# Altium schematic sheet CAN_Transceiver.SchDoc
size 259 x 167 mm; SheetNumber: 12; SheetTotal: 15
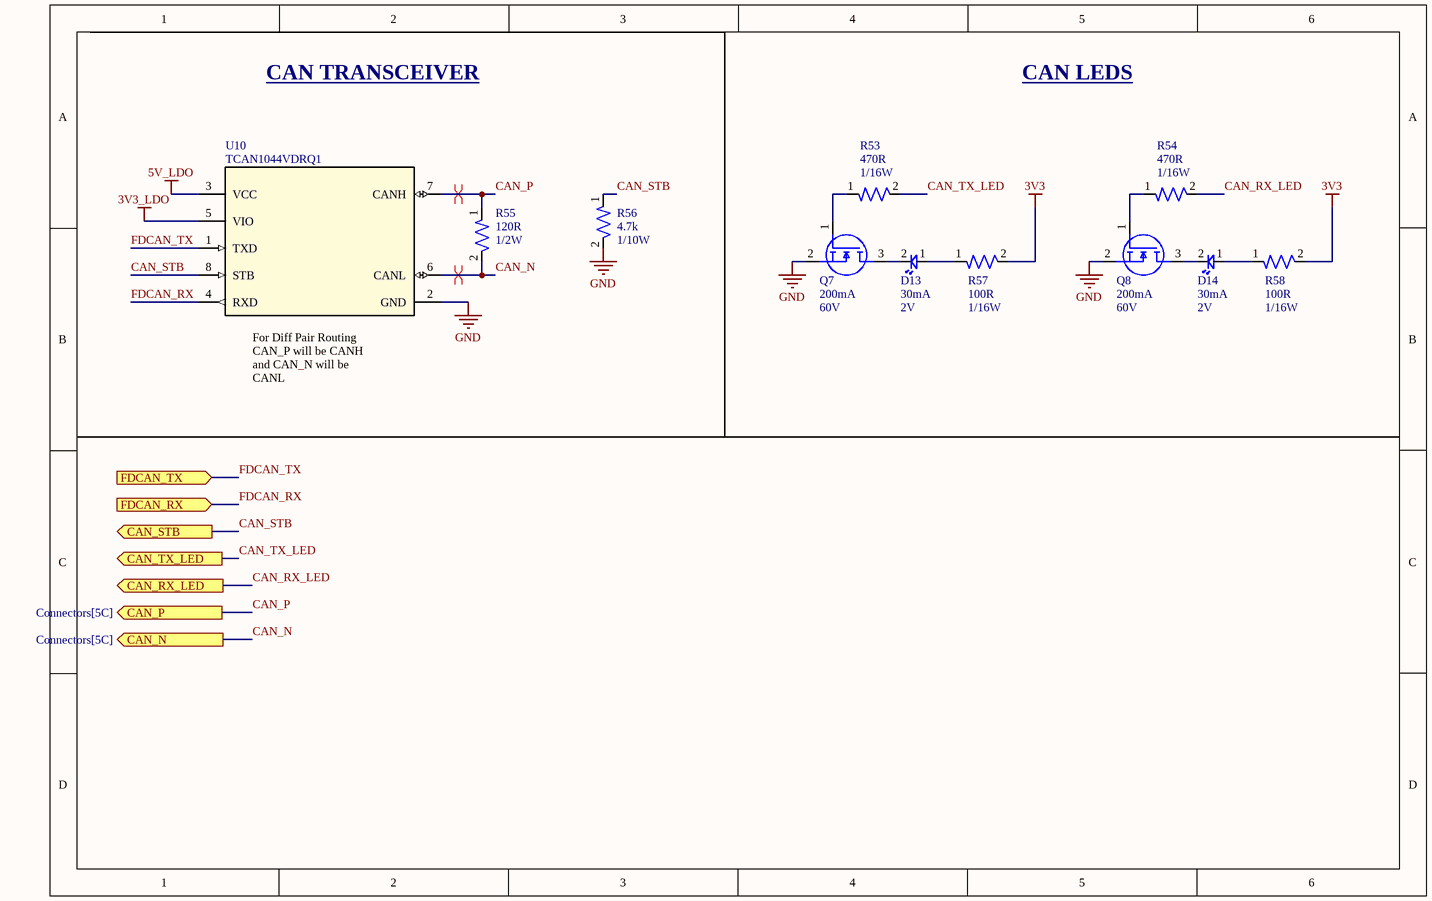
[diagram p0: CAN_Transceiver.SchDoc]

## Parts
D13  Forward Current: 30mA  Forward Voltage: 2V  [LED-0603]  (hidden comment: BL-HKC36G-AV-TRB)
D14  Forward Current: 30mA  Forward Voltage: 2V  [LED-0603]  (hidden comment: BL-HKC36G-AV-TRB)
Q7  Continuous Current: 200mA  Voltage: 60V  [IC-SOT23-3]  (hidden comment: T2N7002AK,LM)
Q8  Continuous Current: 200mA  Voltage: 60V  [IC-SOT23-3]  (hidden comment: T2N7002AK,LM)
R53  Power: 1/16W  Resistance: 470R  [RES-0402]  (hidden comment: RC0402FR-07470RL)
R54  Power: 1/16W  Resistance: 470R  [RES-0402]  (hidden comment: RC0402FR-07470RL)
R55  Power: 1/2W  Resistance: 120R  [RES-1210]  (hidden comment: RC1210FR-07120RL)
R56  Power: 1/10W  Resistance: 4.7k  [RES-0603]  (hidden comment: RC0603FR-074K7L)
R57  Power: 1/16W  Resistance: 100R  [RES-0402]  (hidden comment: RC0402FR-07100RL)
R58  Power: 1/16W  Resistance: 100R  [RES-0402]  (hidden comment: RC0402FR-07100RL)
U10  TCAN1044VDRQ1  [IC-8SOIC]

## Ports
CAN_N (out, see Connectors[5C]), CAN_P (out, see Connectors[5C]), CAN_RX_LED (out, see MCU[6D]), CAN_STB (out, see MCU[6C]), CAN_TX_LED (out, see MCU[6D]), FDCAN_RX (in, see Connectors[5D], MCU[6C]), FDCAN_TX (in, see Connectors[5D], MCU[6C])

## Nets
3V3: R57.2 R58.2
3V3_LDO: U10.5(VIO)
5V_LDO: U10.3(VCC)
GND: Q7.2(S) Q8.2(S) R56.2 U10.2(GND)
CAN_N: R55.2 U10.6(CANL) ; port CAN_N
CAN_P: R55.1 U10.7(CANH) ; port CAN_P
CAN_RX_LED: R54.2 ; port CAN_RX_LED
CAN_STB: R56.1 U10.8(STB) ; port CAN_STB
CAN_TX_LED: R53.2 ; port CAN_TX_LED
FDCAN_RX: U10.4(RXD) ; port FDCAN_RX
FDCAN_TX: U10.1(TXD) ; port FDCAN_TX
NetD13_1: D13.1 R57.1
NetD13_2: D13.2 Q7.3(D)
NetD14_1: D14.1 R58.1
NetD14_2: D14.2 Q8.3(D)
NetQ7_1: Q7.1(G) R53.1
NetQ8_1: Q8.1(G) R54.1

## Layout directives
differential pair: CAN_N, CAN_P

## Notes on the sheet
- CAN TRANSCEIVER
- CAN LEDS
- (near U10) For Diff Pair Routing CAN_P will be CANH and CAN_N will be CANL

## Library data of the parts
D13 D14 = LED-0001: LED YELLOW CLEAR 0603 SMD; ComponentLink1Description: Datasheet; ComponentLink1URL: https://www.americanbrightled.com/pdffiles/led-components/smt/BL-HKC36G-AV-TRB.pdf
Q7 Q8 = NMOS-200MA-0001: MOSFET N-CH 60V 200MA SOT23; ComponentLink1Description: Datasheet; ComponentLink1URL: https://toshiba.semicon-storage.com/info/T2N7002AK_datasheet_en_20150401.pdf?did=29712&prodName=T2N7002AK
R53 R54 = RES-470-0001: RES 470 OHM 1% 1/16W 0402; Tolerance: 1%; Size: 0402; ComponentLink1Description: Datasheet; ComponentLink1URL: https://www.yageo.com/upload/media/product/products/datasheet/rchip/PYu-RC_Group_51_RoHS_L_12.pdf
R55 = RES-120-0001: RES 120 OHM 1% 1/2W 1210; Tolerance: 1%; Size: 1210; ComponentLink1Description: Datasheet; ComponentLink1URL: https://www.yageo.com/upload/media/product/products/datasheet/rchip/PYu-RC_Group_51_RoHS_L_12.pdf
R56 = RES-4.7k-0001: RES 4.7K OHM 1% 1/10W 0603; Tolerance: 1%; Size: 0603; ComponentLink1Description: Datasheet; ComponentLink1URL: https://www.yageo.com/upload/media/product/products/datasheet/rchip/PYu-RC_Group_51_RoHS_L_12.pdf
R57 R58 = RES-100-0001: RES 100 OHM 1% 1/16W 0402; Tolerance: 1%; Size: 0402; ComponentLink1Description: Datasheet; ComponentLink1URL: https://www.yageo.com/upload/media/product/products/datasheet/rchip/PYu-RC_Group_51_RoHS_L_12.pdf
U10 = IC-CAN-0001: IC TRANSCEIVER 1/1 8SOIC; ComponentLink1Description: Datasheet; ComponentLink1URL: https://www.ti.com/lit/ds/symlink/tcan1044-q1.pdf?HQS=dis-dk-null-digikeymode-dsf-pf-null-wwe&ts=1728758303289&ref_url=https%253A%252F%252Fwww.ti.com%252Fgeneral%252Fdocs%252Fsuppproductinfo.tsp%253FdistId%253D10%2526gotoUrl%253Dhttps%253A%252F%252Fwww.ti.com%252Flit%252Fgpn%252Ftcan1044-q1